# EAGLE design cellular (EAGLE 5.03)
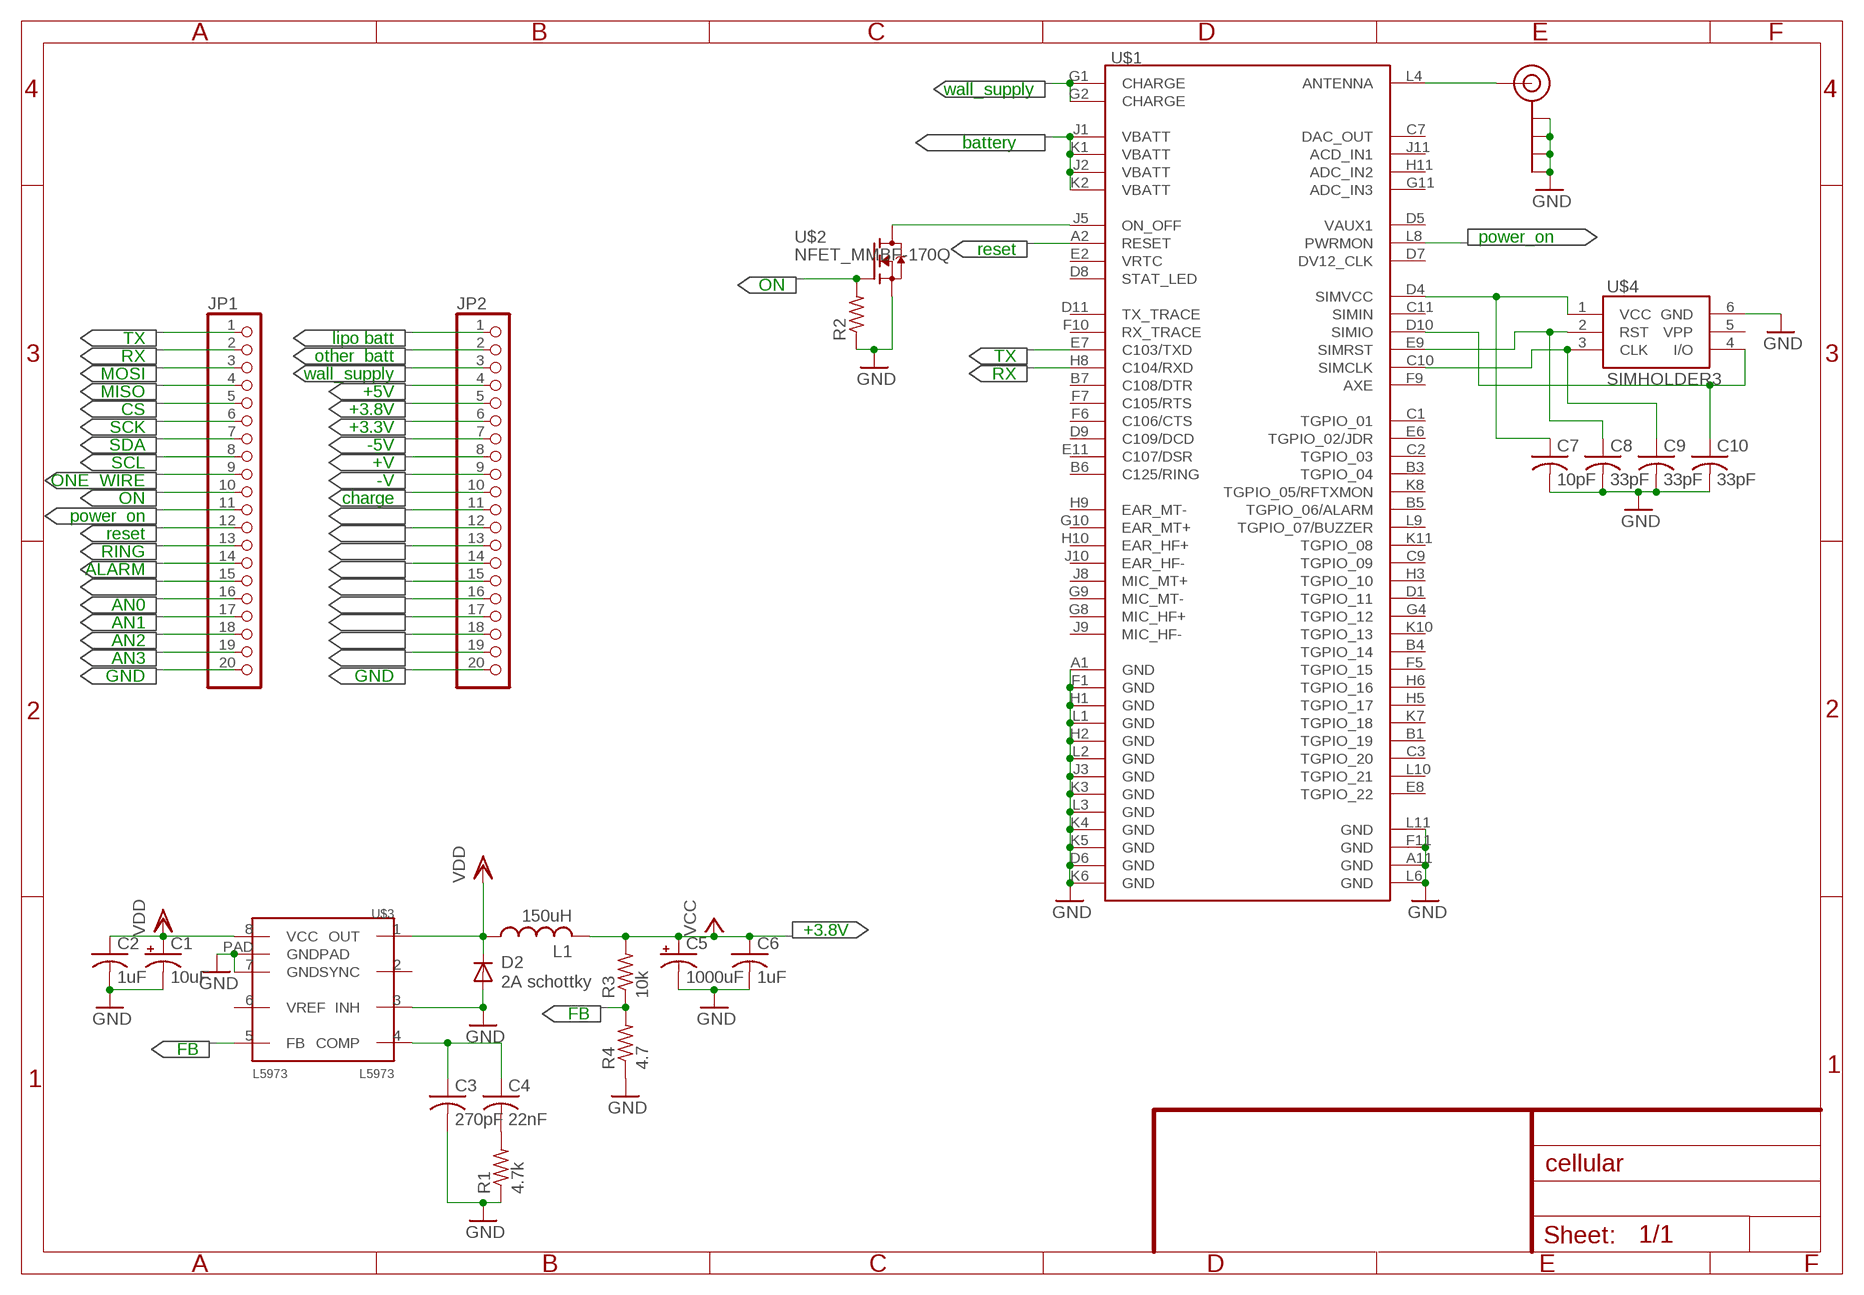
[diagram p0: schematic, sheet 1]

## Parts
C1  10uF  CPOL-US153CLV-0605  [153CLV-0605]
C2  1uF  C-USC0603  [C0603]
C3  270pF  C-USC0603  [C0603]
C4  22nF  C-USC0603  [C0603]
C5  1000uF  NICHICON_19MM_CAPACITOR  [19MM_ELECTROLYTIC_CAP]
C6  1uF  C-USC0603  [C0603]
C7  10pF  C-USC0603  [C0603]
C8  33pF  C-USC0603  [C0603]
C9  33pF  C-USC0603  [C0603]
C10  33pF  C-USC0603  [C0603]
D2  2A schottky  DIODESMB  [SMB-DIODE]
J$1  SMA_EDGE  [SMA-EDGE]
JP1  PINHD-1X20  [1X20]
JP2  PINHD-1X20  [1X20]
L1  150uH  1806_BOURNS_INDUCTOR  [1806_INDUCTOR]
R1  4.7k  R-US_R0603  [R0603]
R2  R-US_R0603  [R0603]
R3  10k  R-US_R0603  [R0603]
R4  4.7  R-US_R0603  [R0603]
U$1  GE864  [GE864]
U$2  NFET_MMBF-170Q  [SOT23]
U$3  L5973  [HSOP8]
U$4  SIMHOLDER3  [SIMHOLDER3]

## Nets
+3.3V: JP2.6
+5V: JP2.4
+V: JP2.8
-5V: JP2.7
-V: JP2.9
BATTERY: U$1.J1(VBATT) U$1.J2(VBATT) U$1.K1(VBATT) U$1.K2(VBATT)
CHARGE: JP2.10
CS: JP1.5
FB: R3.1 R4.2 U$3.5(FB)
GND: C1.- C2.2 C3.2 C5.- C6.2 C7.2 C8.2 C9.2 C10.2 D2.A J$1.GND@0(GND) J$1.GND@1(GND) J$1.GND@2(GND) J$1.GND@3(GND) R1.1 R2.1 R4.1 U$1.A1(GND) U$1.A11(GND) U$1.D6(GND) U$1.F1(GND) U$1.F11(GND) U$1.H1(GND) U$1.H2(GND) U$1.J3(GND) U$1.K3(GND) U$1.K4(GND) U$1.K5(GND) U$1.K6(GND) U$1.L1(GND) U$1.L2(GND) U$1.L3(GND) U$1.L6(GND) U$1.L11(GND) U$2.2(S) U$3.3(INH) U$3.7(GND) U$3.PAD(GNDPAD) U$4.6(GND)
LIPO_BATT: JP2.1
MISO: JP1.4
MOSI: JP1.3
N$2: C7.1 U$1.D4(SIMVCC) U$4.1(VCC)
N$3: C8.1 U$1.E9(SIMRST) U$4.2(RST)
N$4: C9.1 U$1.C10(SIMCLK) U$4.3(CLK)
N$5: C10.1 U$1.D10(SIMIO) U$4.4(I/O)
N$8: U$1.J5(ON_OFF) U$2.3(D)
N$9: C4.2 R1.2
N$10: C3.1 C4.1 U$3.4(COMP)
N$18: J$1.SIG(SIGNAL) U$1.L4(ANTENNA)
N$40: U$1.A2(RESET)
ON: R2.2 U$2.1(G)
ONE_WIRE: JP1.9
OTHER_BATT: JP2.2
POWER_ON: U$1.L8(PWRMON)
RIN: JP1.13
RX: JP1.2 U$1.H8(C104/RXD)
SCK: JP1.6
SCL: JP1.8
SDA: JP1.7
TX: JP1.1 U$1.E7(C103/TXD)
VCC: C5.+ C6.1 JP2.5 L1.P$2 R3.2
VDD: C1.+ C2.1 D2.C L1.P$1 U$3.1(OUT) U$3.8(VCC)
WALL_SUPPLY: JP2.3 U$1.G1(CHARGE) U$1.G2(CHARGE)
Unconnected: JP1.10 JP1.11 JP1.12 JP1.14 JP1.15 JP1.16 JP1.17 JP1.18 JP1.19 JP1.20 JP2.11 JP2.12 JP2.13 JP2.14 JP2.15 JP2.16 JP2.17 JP2.18 JP2.19 JP2.20 U$1.B1(TGPIO_19) U$1.B3(TGPIO_04) U$1.B4(TGPIO_14) U$1.B5(TGPIO_06/ALARM) U$1.B6(C125/RING) U$1.B7(C108/DTR) U$1.C1(TGPIO_01) U$1.C2(TGPIO_03) U$1.C3(TGPIO_20) U$1.C7(DAC_OUT) U$1.C9(TGPIO_09) U$1.C11(SIMIN) U$1.D1(TGPIO_11) U$1.D5(VAUX1) U$1.D7(DV12_CLK) U$1.D8(STAT_LED) U$1.D9(C109/DCD) U$1.D11(TX_TRACE) U$1.E2(VRTC) U$1.E6(TGPIO_02/JDR) U$1.E8(TGPIO_22) U$1.E11(C107/DSR) U$1.F5(TGPIO_15) U$1.F6(C106/CTS) U$1.F7(C105/RTS) U$1.F9(AXE) U$1.F10(RX_TRACE) U$1.G4(TGPIO_12) U$1.G8(MIC_HF+) U$1.G9(MIC_MT-) U$1.G10(EAR_MT+) U$1.G11(ADC_IN3) U$1.H3(TGPIO_10) U$1.H5(TGPIO_17) U$1.H6(TGPIO_16) U$1.H9(EAR_MT-) U$1.H10(EAR_HF+) U$1.H11(ADC_IN2) U$1.J8(MIC_MT+) U$1.J9(MIC_HF-) U$1.J10(EAR_HF-) U$1.J11(ACD_IN1) U$1.K7(TGPIO_18) U$1.K8(TGPIO_05/RFTXMON) U$1.K10(TGPIO_13) U$1.K11(TGPIO_08) U$1.L9(TGPIO_07/BUZZER) U$1.L10(TGPIO_21) U$3.2(SYNC) U$3.6(VREF) U$4.5(VPP)

## Notes on the sheet
- wall_supply
- battery
- reset | power_on
- ON
- TX | lipo batt
- RX | other_batt | TX
- MOSI | wall_supply | RX
- MISO | +5V
- CS | +3.8V
- SCK | +3.3V
- SDA | -5V
- SCL | +V
- ONE_WIRE | -V
- ON | charge
- power_on
- reset
- RING
- ALARM
- AN0
- AN1
- AN2
- AN3
- GND | GND
- +3.8V
- FB
- FB

## Library data of the parts
C1 = rcl:CPOL-US: POLARIZED CAPACITOR, American symbol
C2-C4 C6-C10 = rcl:C-US: CAPACITOR, American symbol
C5 = nublabs:NICHICON_19MM_CAPACITOR: Aluminum Electrolytic Cap nichicon UUE1E102MNS1ZD available from mouser
D2 = SparkFun:DIODE: Diode These are standard reverse protection diodes and small signal diodes. SMA package can handle up to about 1A. SOD-323 can handle about 200mA. What the SOD-323 package when ordering, there are some mfgs out there that are 5-pin packages.
J$1 = SparkFun:SMA_EDGE: SMA Antenna Connector End launch SMA connector. The paste layer has been removed so that the connector can be hand soldered onto the board after reflow.
JP1 JP2 = pinhead:PINHD-1X20: PIN HEADER
L1 = nublabs:1806_BOURNS_INDUCTOR
R1-R4 = rcl:R-US_: RESISTOR, American symbol
U$1 = SparkFun:GE864
U$2 = nublabs:NFET_MMBF-170Q
U$3 = nublabs:L5973: The L5973 is an adjustable step-down regulator that can handle up to 2.5A
U$4 = SparkFun:SIMHOLDER3

## Board
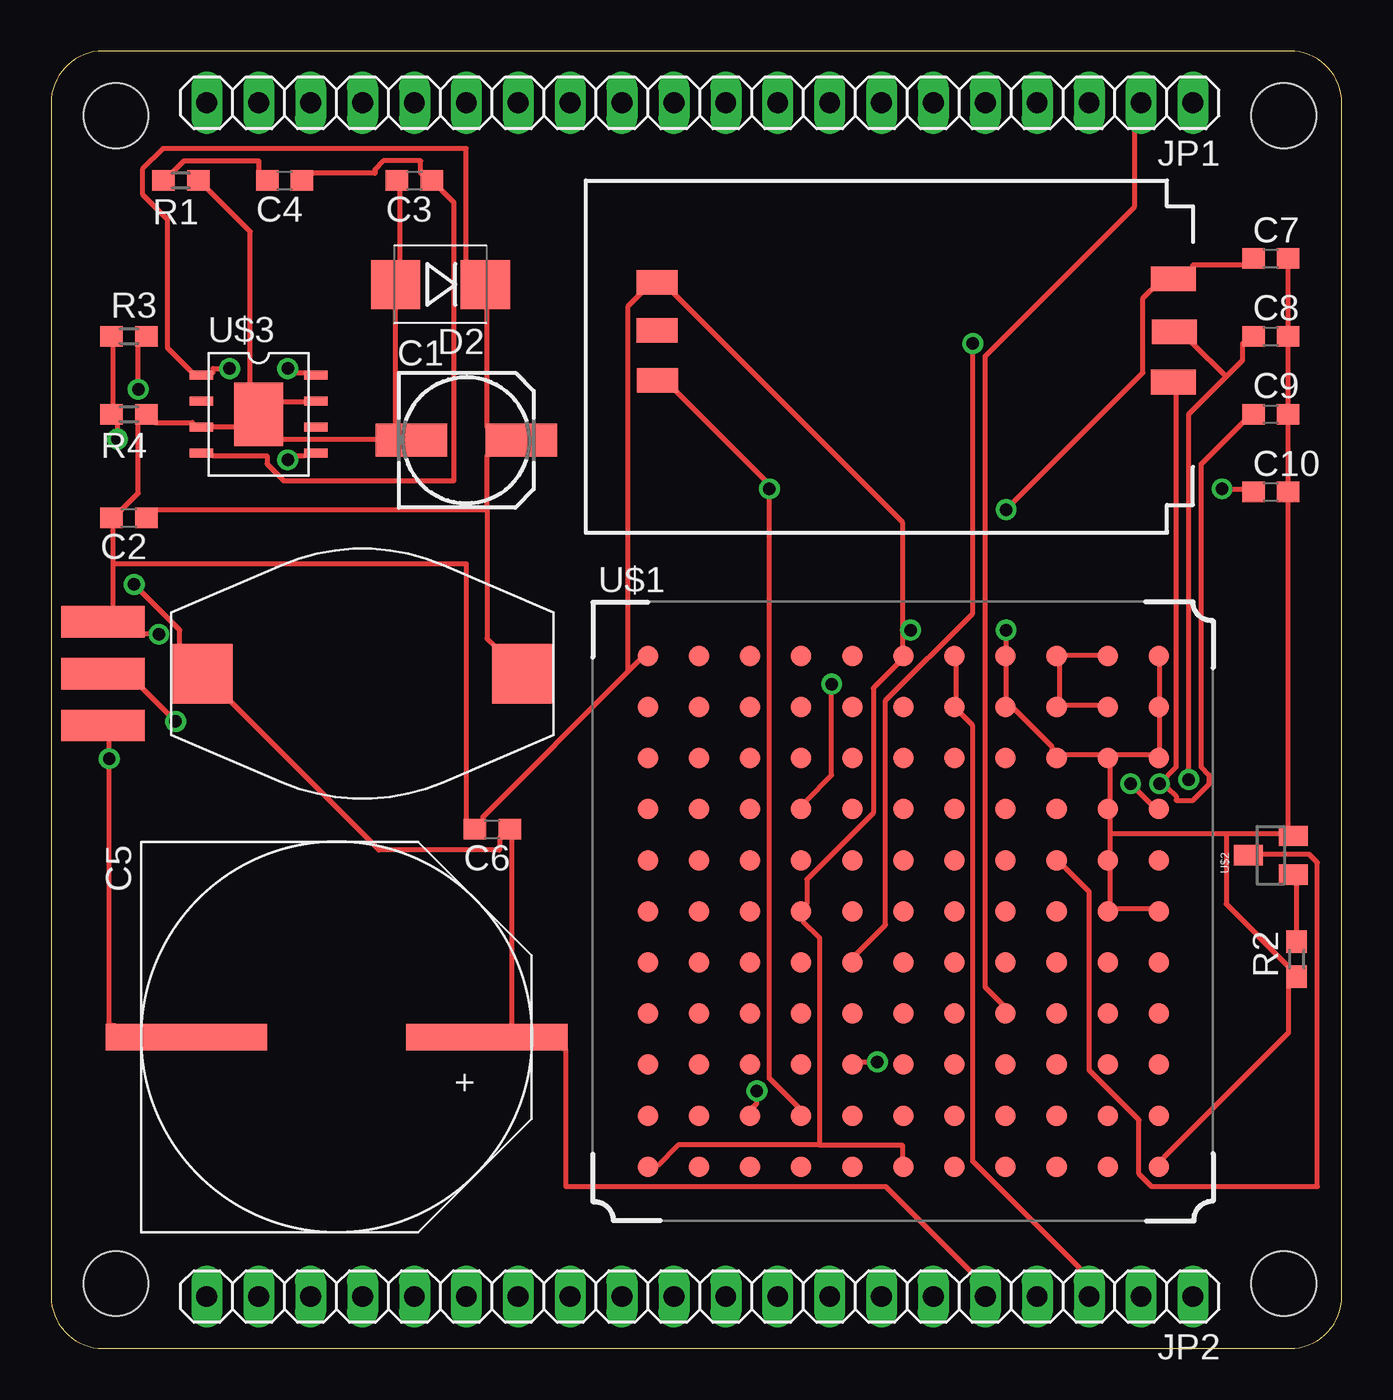
[diagram p1: board, top side]
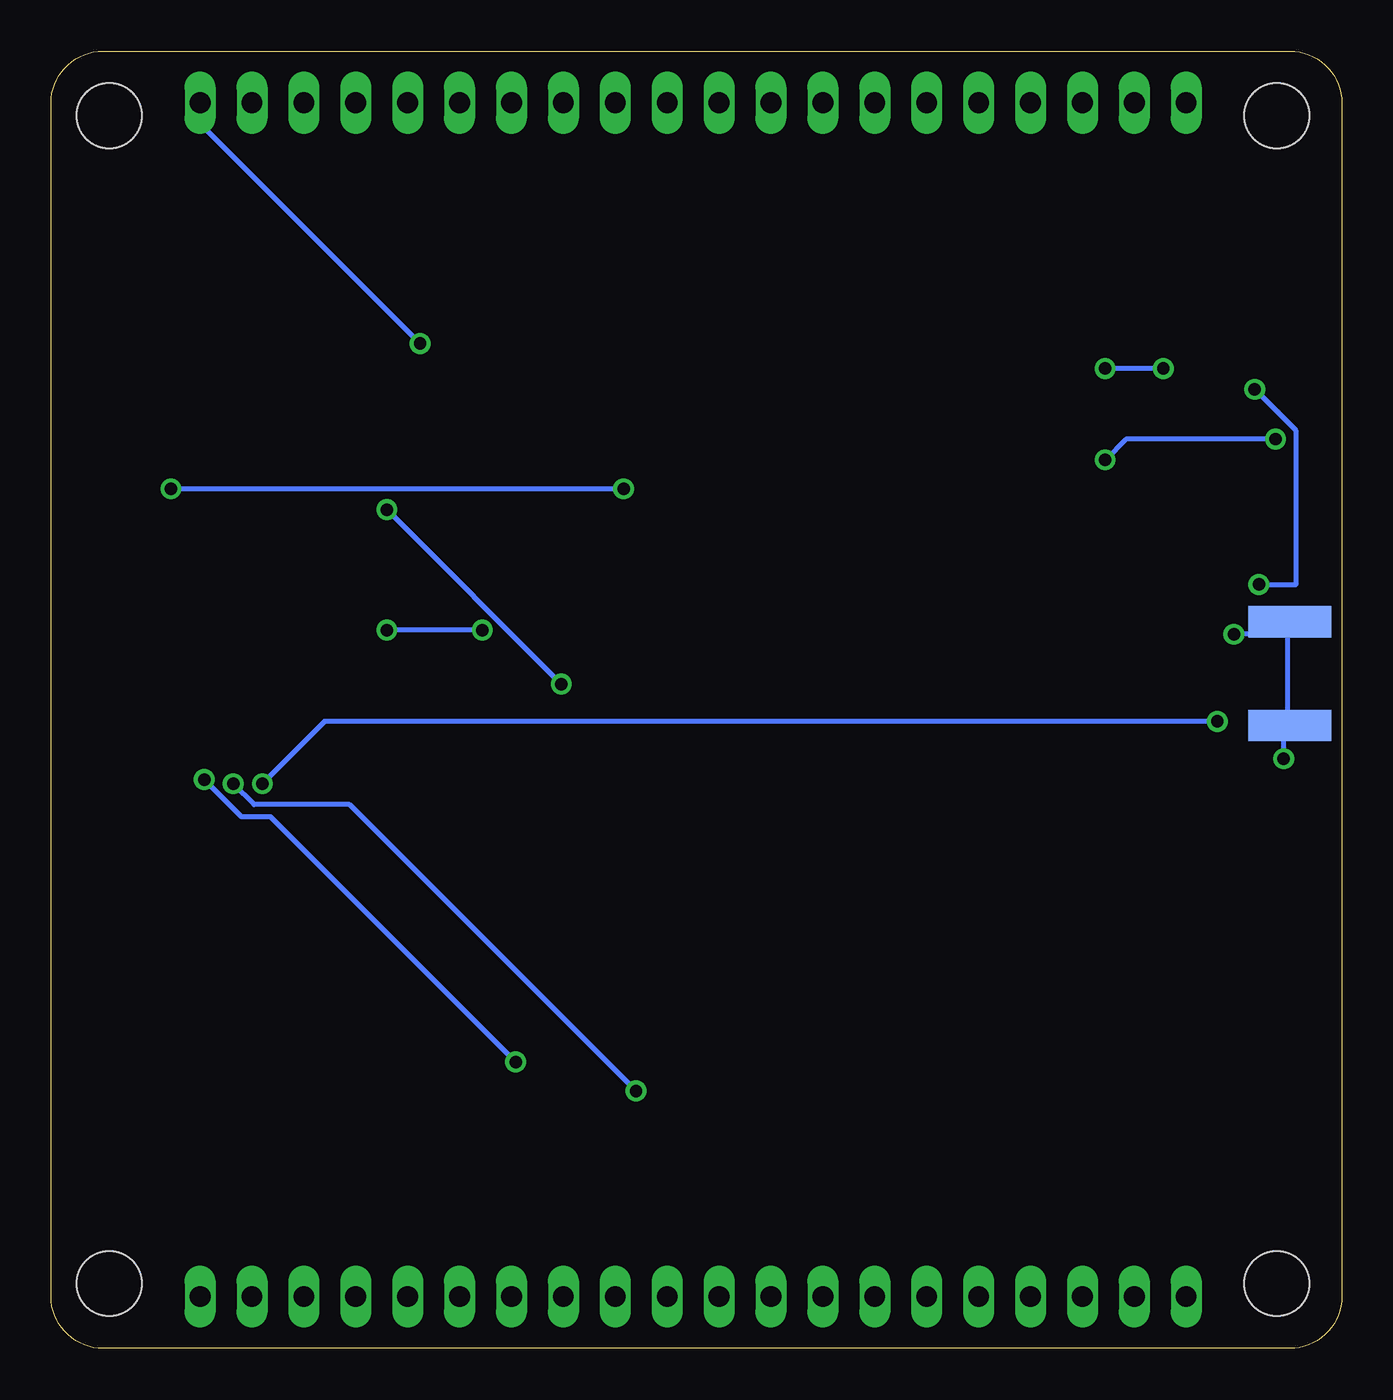
[diagram p2: board, bottom side, seen from below]

Size 63.17 x 63.49 mm. Coordinates in mm from the lower left corner, seen from the top.
Outline: 60.63,0 arc90 63.17,2.54 63.17,60.95 arc90 60.63,63.49 2.54,63.49 arc90 0,60.95 0,2.54 arc90 2.54,0 60.63,0
Copper layers (1*16): Top 0.035mm / dielectric 1.5mm / Bottom 0.035mm
Design rules "default": minimum track width 10mil, minimum drill 24mil, track to track 8mil, track to pad 8mil, pad to pad 8mil, via to via 8mil, smd to smd 8mil, copper to edge 40mil, drill to drill 8mil, minimum pad ring 10mil, minimum via ring 8mil, stop-mask expansion 4mil, vias tented up to drill 0mil, thermal gap 10mil
Holes 3.17 mm at 3.17,3.17 60.33,3.17 60.33,60.33 3.17,60.33

### Footprints (pad centres in the part's own frame; a part is rotated, then mirrored left to right if it is on the bottom)
153CLV-0605 = smd 3.5 x 1.6: + 2.7,0; - -2.7,0
C0603 = smd 1.1 x 1: 1 -0.85,0; 2 0.85,0
19MM_ELECTROLYTIC_CAP = smd 1.3 x 7.9: + 0,7.35; - 0,-7.35
SMB-DIODE = smd 2.4 x 2.4: A 2.2,0; C -2.2,0
SMA-EDGE = smd 1.524 x 4.064: GND@0 0,0; GND@1 5.08,0; SIG 2.54,0 | smd 1.524 x 4.064 bottom: GND@2 0,0; GND@3 5.08,0
1X20 = drill 1.016 long: 1 -24.13,0; 2 -21.59,0; 3 -19.05,0; 4 -16.51,0; 5 -13.97,0; 6 -11.43,0; 7 -8.89,0; 8 -6.35,0; 9 -3.81,0; 10 -1.27,0; 11 1.27,0; 12 3.81,0; 13 6.35,0; 14 8.89,0; 15 11.43,0; 16 13.97,0; 17 16.51,0; 18 19.05,0; 19 21.59,0; 20 24.13,0
1806_INDUCTOR = smd 3 x 2.9: P$1 7.85,0; P$2 -7.85,0
R0603 = smd 1.1 x 1: 1 -0.85,0; 2 0.85,0
GE864 = smd 1 x 1: A1 0,25; A2 0,22.5; A3 0,20; A4 0,17.5; A5 0,15; A6 0,12.5; A7 0,10; A8 0,7.5; A9 0,5; A10 0,2.5; A11 0,0; B1 2.5,25; B2 2.5,22.5; B3 2.5,20; B4 2.5,17.5; B5 2.5,15; B6 2.5,12.5; B7 2.5,10; B8 2.5,7.5; B9 2.5,5; B10 2.5,2.5; B11 2.5,0; C1 5,25; C2 5,22.5; C3 5,20; C4 5,17.5; C5 5,15; C6 5,12.5; C7 5,10; C8 5,7.5; C9 5,5; C10 5,2.5; C11 5,0; D1 7.5,25; D2 7.5,22.5; D3 7.5,20; D4 7.5,17.5; D5 7.5,15; D6 7.5,12.5; D7 7.5,10; D8 7.5,7.5; D9 7.5,5; D10 7.5,2.5; D11 7.5,0; E1 10,25; E2 10,22.5; E3 10,20; E4 10,17.5; E5 10,15; E6 10,12.5; E7 10,10; E8 10,7.5; E9 10,5; E10 10,2.5; E11 10,0; F1 12.5,25; F2 12.5,22.5; F3 12.5,20; F4 12.5,17.5; F5 12.5,15; F6 12.5,12.5; F7 12.5,10; F8 12.5,7.5; F9 12.5,5; F10 12.5,2.5; F11 12.5,0; G1 15,25; G2 15,22.5; G3 15,20; G4 15,17.5; G5 15,15; G6 15,12.5; G7 15,10; G8 15,7.5; G9 15,5; G10 15,2.5; G11 15,0; H1 17.5,25; H2 17.5,22.5; H3 17.5,20; H4 17.5,17.5; H5 17.5,15; H6 17.5,12.5; H7 17.5,10; H8 17.5,7.5; H9 17.5,5; H10 17.5,2.5; H11 17.5,0; J1 20,25; J2 20,22.5; J3 20,20; J4 20,17.5; J5 20,15; J6 20,12.5; J7 20,10; J8 20,7.5; J9 20,5; J10 20,2.5; J11 20,0; K1 22.5,25; K2 22.5,22.5; K3 22.5,20; K4 22.5,17.5; K5 22.5,15; K6 22.5,12.5; K7 22.5,10; K8 22.5,7.5; K9 22.5,5; K10 22.5,2.5; K11 22.5,0; L1 25,25; L2 25,22.5; L3 25,20; L4 25,17.5; L5 25,15; L6 25,12.5; L7 25,10; L8 25,7.5; L9 25,5; L10 25,2.5; L11 25,0
SOT23 = smd 1 x 1.4: 1 -0.95,-1.1; 2 0.95,-1.1; 3 0,1.1
HSOP8 = smd 1.16 x 0.45: 1 -2.8,1.905; 2 -2.8,0.635; 3 -2.8,-0.635; 4 -2.8,-1.905; 5 2.8,-1.905; 6 2.8,-0.635; 7 2.8,0.635; 8 2.8,1.905 | smd 2.4 x 3.1: PAD 0,0
SIMHOLDER3 = smd 2.2 x 1.2: 1 0.95,4.81; 2 0.91,7.41; 3 0.95,9.86 | smd 2 x 1.2: 4 26.2,9.78; 5 26.22,7.34; 6 26.22,4.98

### Placement (x,y rotation side)
C1  20.32,44.45 0 top
C2  3.81,40.64 180 top
C3  17.78,57.15 180 top
C4  11.43,57.15 180 top
C5  13.97,15.24 270 top
C6  21.59,25.4 180 top
C7  59.69,53.34 0 top
C8  59.69,49.53 0 top
C9  59.69,45.72 0 top
C10  59.69,41.91 0 top
D2  19.05,52.07 180 top
J$1  2.54,30.48 90 top
JP1  31.75,60.96 180 top
JP2  31.75,2.54 180 top
L1  15.24,33.02 0 top
R1  6.35,57.15 180 top
R2  60.96,19.05 90 top
R3  3.81,49.53 0 top
R4  3.81,45.72 180 top
U$1  29.21,8.89 0 top
U$2  59.69,24.13 90 top
U$3  10.16,45.72 0 top
U$4  55.88,57.15 180 top

### Tracks (layer width: path | path; a pad name or v marks a point on that pad's centre or on a via)
BATTERY
  Top 0.254: U$1.K2 51.41,31.5 49.58,31.5 U$1.J2 49.38,31.7 49.38,33.53 U$1.J1 49.58,33.93 51.41,33.93 U$1.K1
FB  (via drill 0.61)
  Top 0.254: R3.1 3.05,49.17 3.05,46.13 R4.2 3.25,45.31 v3.25,44.5 | v11.58,43.48 11.58,43.69 12.39,43.69 U$3.5
  Bottom 0.254: v11.58,43.48 10.57,44.5 v3.25,44.5
GND  (via drill 0.61)
  Top 0.254: J$1.GND@0 2.85,29.87 v2.85,28.85 2.85,15.85 C5.- | 3.05,38.41 3.05,36.17 J$1.GND@1 4.47,34.95 v5.28,34.95 | 3.05,38.41 3.05,40.23 C2.2 3.45,41.05 4.27,41.86 4.27,45.31 R4.1 5.08,45.31 6.91,45.31 6.91,45.11 U$3.3 7.92,45.11 9.14,45.11 U$3.PAD | C3.2 17.07,56.69 17.07,53.24 D2.A 16.87,51 16.87,45.11 C1.- 16.05,44.5 11.18,44.5 U$3.PAD | R1.1 7.72,56.69 9.75,54.66 9.75,47.14 U$3.PAD | U$3.7 12.39,46.33 11.18,46.33 U$3.PAD | U$1.L11 54.46,9.35 60.55,15.44 60.55,17.68 R2.1 60.55,18.69 57.51,21.74 57.51,25.2 | U$1.L1 54.25,33.53 54.25,31.7 U$1.L2 54.25,31.09 54.25,29.26 U$1.L3 53.85,29.06 52.02,29.06 U$1.K3 | U$1.K3 51.41,29.06 49.58,29.06 U$1.J3 48.97,29.26 48.97,29.46 47.14,31.29 U$1.H2 46.74,31.7 46.74,33.53 U$1.H1 46.74,34.34 v46.74,35.15 | C7.2 60.55,53.03 60.55,49.99 C8.2 60.55,49.17 60.55,46.13 C9.2 60.55,45.31 60.55,42.27 C10.2 60.55,41.45 60.55,25.4 U$2.2 60.15,25.2 57.51,25.2 | U$1.L6 53.85,21.54 52.02,21.54 U$1.K6 51.82,21.74 51.82,23.57 U$1.K5 51.82,24.38 51.82,25.2 | 51.82,25.2 51.82,26.01 U$1.K4 51.82,26.82 51.82,28.45 U$1.K3 | 51.82,25.2 57.51,25.2 | 28.25,33.12 21.13,26.01 21.13,25.81 C6.2 20.32,25.81 20.32,38.41 3.05,38.41 | 28.25,33.12 28.85,33.73 U$1.A1 | 28.25,33.12 28.25,51 28.85,51.61 U$4.6 30.48,51.61 41.66,40.44 41.66,35.15 | 37.59,9.96 41.66,9.96 41.66,9.35 U$1.F11 | 37.59,9.96 30.68,9.96 29.67,8.94 U$1.A11 | 37.59,9.96 37.59,20.12 36.78,20.93 U$1.D6 36.98,21.74 36.98,22.96 40.23,26.21 40.23,32.31 41.45,33.53 U$1.F1 41.66,34.34 41.66,35.15 | 41.66,35.15 v42.06,35.15
  Bottom 0.254: v2.85,28.85 2.85,29.87 J$1.GND@0 2.64,31.09 2.64,34.95 J$1.GND@1 4.47,34.95 v5.28,34.95 | v42.06,35.15 v46.74,35.15
N$2  (via drill 0.61)
  Top 0.254: v38.2,32.51 38.2,28.04 36.98,26.82 U$1.D4 | v46.74,41.05 53.44,47.75 53.44,51.41 53.85,51.82 U$4.1 55.88,52.83 55.88,53.03 58.32,53.03 C7.1
  Bottom 0.254: v38.2,32.51 v46.74,41.05
N$3  (via drill 0.61)
  Top 0.254: v40.44,14.02 39.62,14.02 U$1.E9 | v55.68,27.84 55.68,45.72 57.51,47.55 | 57.51,47.55 58.32,48.36 58.32,49.17 C8.1 | 57.51,47.55 55.88,49.17 U$4.2
  Bottom 0.254: v40.44,14.02 52.43,26.01 53.85,26.01 v55.68,27.84
N$4  (via drill 0.61)
  Top 0.254: v34.54,12.6 34.54,11.99 34.34,11.79 U$1.C10 | U$4.3 55.07,46.74 55.07,28.45 v54.25,27.64 54.66,27.43 55.07,27.03 55.07,26.82 55.88,26.82 56.69,27.64 56.69,28.04 56.29,28.45 56.29,43.28 58.32,45.31 C9.1
  Bottom 0.254: v34.54,12.6 48.56,26.62 53.24,26.62 v54.25,27.64
N$5  (via drill 0.61)
  Top 0.254: U$1.D10 36.58,11.79 35.15,13.21 v35.15,42.06 35.15,42.27 30.48,46.94 U$4.4 | v57.3,42.06 58.32,42.06 C10.1
  Bottom 0.254: v35.15,42.06 v57.3,42.06
N$8
  Top 0.254: U$1.J5 49.58,23.57 50.8,22.35 50.8,13.61 53.24,11.18 53.24,8.53 53.85,7.92 61.98,7.92 61.98,23.77 61.57,24.18 59.13,24.18 U$2.3
N$9
  Top 0.254: R1.2 5.89,57.51 6.5,58.12 10.16,58.12 10.16,57.51 C4.2
N$10
  Top 0.254: C4.1 12.8,57.51 15.85,57.51 15.85,57.71 16.26,58.12 18.09,58.12 18.09,57.51 C3.1 19.1,56.69 19.71,56.08 19.71,42.47 11.38,42.47 10.57,43.28 10.57,43.69 7.92,43.69 U$3.4
N$18  (via drill 0.61)
  Top 0.254: v52.83,27.64 53.85,26.62 U$1.L4 | v6.1,30.68 4.47,32.31 J$1.SIG
  Bottom 0.254: v52.83,27.64 49.78,30.68 v6.1,30.68
ON
  Top 0.254: R2.2 60.96,22.76 U$2.1
RX
  Top 0.254: U$1.H8 46.53,16.87 45.72,17.68 45.72,48.56 53.03,55.88 53.03,59.54 JP1.2
TX  (via drill 0.61)
  Top 0.254: v45.11,49.17 45.11,35.97 40.84,31.7 40.84,20.73 39.42,19.3 U$1.E7
  Bottom 0.254: v45.11,49.17 55.47,59.54 JP1.1
VCC  (via drill 0.61)
  Top 0.254: v4.27,46.94 4.27,49.17 R3.2 | v4.06,37.39 6.3,35.15 6.3,34.34 L1.P$2 8.74,31.7 16.05,24.38 21.95,24.38 21.95,24.99 C6.1 22.55,24.99 22.55,15.85 C5.+ 25.2,14.63 25.2,7.92 40.84,7.92 45.11,3.66 JP2.5
  Bottom 0.254: v4.27,46.94 2.23,44.91 2.23,37.39 v4.06,37.39
VDD  (via drill 0.61)
  Top 0.254: v11.58,47.95 11.58,47.75 12.39,47.75 U$3.8 | v8.74,47.95 7.92,47.95 7.92,47.75 U$3.1 6.91,47.75 5.69,48.97 5.69,55.27 4.47,56.49 4.47,57.71 5.49,58.73 20.32,58.73 20.32,53.24 D2.C 21.34,51 21.34,45.11 C1.+ 21.34,43.69 21.34,41.05 | 21.34,41.05 5.08,41.05 C2.1 | 21.34,41.05 21.34,34.75 21.74,34.34 L1.P$1
  Bottom 0.254: v8.74,47.95 v11.58,47.95
WALL_SUPPLY
  Top 0.254: U$1.G1 44.3,33.53 44.3,31.7 U$1.G2 44.5,31.09 45.11,30.48 45.11,9.14 50.39,3.86 JP2.3